# EasyEDA Pro project EasyEDA.epro

# Schematic Schematic1
Board Name: Board1; Create Date: 2025-07-10; Page Name: P1; Project Name: Pomodoro; Schematic Name: Schematic1; Update Date: 2025-07-14; Company: EasyEDA.com; Page Size: A4; Version: V1.0
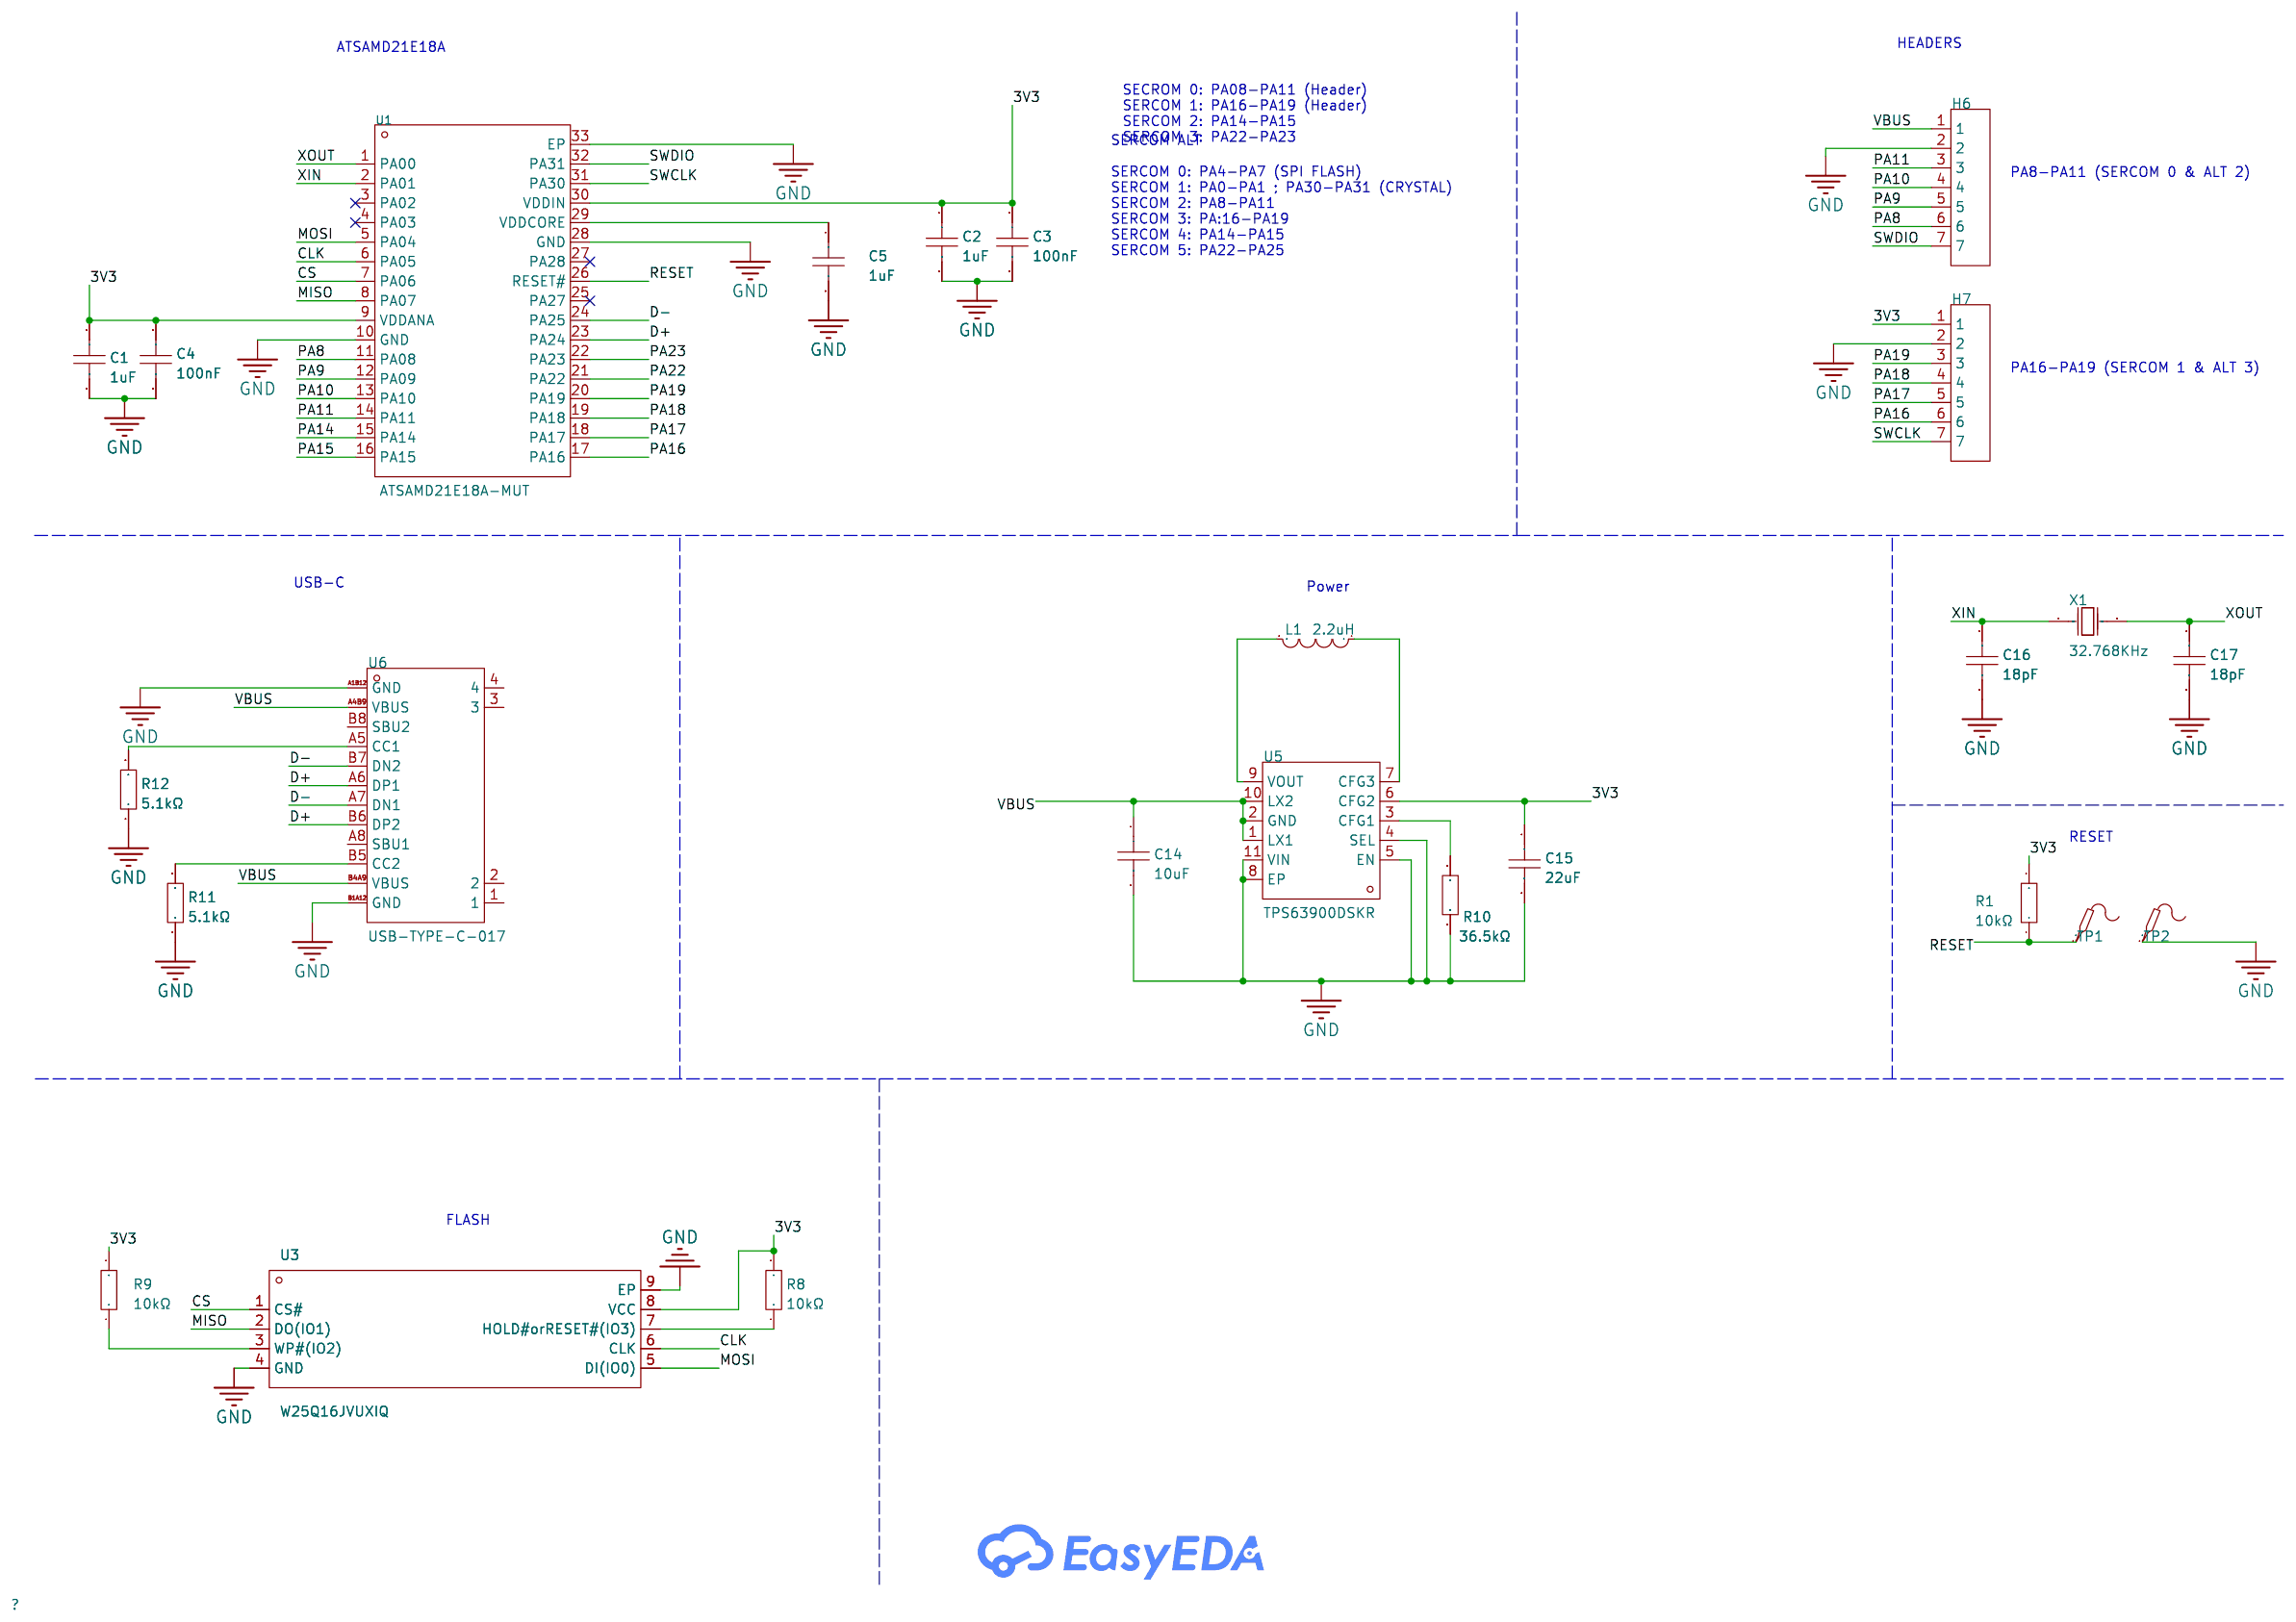
[diagram p0: schematic sheet]

## Parts
C1  1uF  [C0402]
C2  1uF  [C0402]
C3  100nF  [C0402]
C4  100nF  [C0402]
C5  1uF  [C0402]
C14  10uF  [C0402]
C15  22uF  [C0805]
C16  18pF  [C0402]
C17  18pF  [C0402]
H6  -  [HDR-TH_7P-P2.54-V-M]
H7  -  [HDR-TH_7P-P2.54-V-M]
L1  2.2uH  [IND-SMD_L4.5-W4.0_SLF0403-1]
R1  10kΩ  [R0402]
R8  10kΩ  [R0402]
R9  10kΩ  [R0402]
R10  36.5kΩ  [R0402]
R11  5.1kΩ  [R0402]
R12  5.1kΩ  [R0402]
TP1  -  [Test-Point-0.5mm]
TP2  -  [Test-Point-0.5mm]
U1  ATSAMD21E18A-MUT  [QFN-32_L5.0-W5.0-P0.50-TL-EP3.6]
U3  W25Q16JVUXIQ  [USON-8_L3.0-W2.0-P0.50-BL-EP]
U5  TPS63900DSKR  [WSON-10_L2.5-W2.5-W0.50-TL-EP]
U6  USB-TYPE-C-017  [USB-TYPE-C-SMD_C9900008089]
X1  32.768KHz  [OSC-SMD_L3.2-W1.5]

## Library data of the parts
C1 C2 C5 = CL05A105KA5NQNC: Capacitance: Tolerance:±10% Tolerance:±10% Voltage Rated: Temperature Coefficient:; LCSC Part Name: 1uF ±10% 25V; Supplier Part: C52923; Manufacturer: SAMSUNG(三星); Supplier Footprint: 0402; JLCPCB Part Class: Basic Part; Datasheet: https://atta.szlcsc.com/upload/public/pdf/source/20160218/1457707763339.pdf; Supplier: LCSC; Tolerance: ±10%
C3 C4 = CL05B104KO5NNNC: Capacitance: Tolerance:±10% Tolerance:±10% Voltage Rated: Temperature Coefficient:; LCSC Part Name: 100nF ±10% 16V; Supplier Part: C1525; Manufacturer: SAMSUNG(三星); Supplier Footprint: 0402; JLCPCB Part Class: Basic Part; Datasheet: https://atta.szlcsc.com/upload/public/pdf/source/20160218/1457707763339.pdf; Supplier: LCSC; Tolerance: ±10%
C14 = CL05A106MQ5NUNC: Capacitance: Tolerance:±20% Tolerance:±20% Voltage Rated: Temperature Coefficient:; LCSC Part Name: 10uF ±20% 6.3V; Supplier Part: C15525; Manufacturer: SAMSUNG(三星); Supplier Footprint: 0402; JLCPCB Part Class: Basic Part; Datasheet: https://atta.szlcsc.com/upload/public/pdf/source/20220823/2B02EE04F8F211D38A52DCB16EB6BEBA.pdf; Supplier: LCSC; Tolerance: ±20%
C15 = CL21A226MAQNNNE: Capacitance: Tolerance:±20% Tolerance:±20% Voltage Rated: Temperature Coefficient:; LCSC Part Name: 22uF ±20% 25V; Supplier Part: C45783; Manufacturer: SAMSUNG(三星); Supplier Footprint: 0805; JLCPCB Part Class: Basic Part; Datasheet: https://atta.szlcsc.com/upload/public/pdf/source/20160218/1457707763339.pdf; Supplier: LCSC; Tolerance: ±20%
C16 C17 = CAP_0402: Supplier Part: C1525; Supplier Footprint: 0402
H6 H7 = HDR-M_2.54_1x7P: Supplier Footprint: Through
L1 = CY43-2.2UH: Inductance: Tolerance:±20% Tolerance:±20% Rated Current: Saturation Current (Isat):- DC Resistance (DCR): Q @ Freq:- Frequency - Self Resonant:- Ratings:; LCSC Part Name: 2.2uH ±20%; Supplier Part: C2929416; Manufacturer: SHOU HAN(首韩); Supplier Footprint: SMD,4.5x4mm; JLCPCB Part Class: Extended Part; Datasheet: https://atta.szlcsc.com/upload/public/pdf/source/20211213/02D0D236E4480B75E64C77ABE9E913B4.pdf; Supplier: LCSC; Tolerance: ±20%
R1 R8 R9 = 0402WGF1002TCE: Type:Thick Film Resistors Resistance:10kΩ Tolerance:±1% Tolerance:±1% Power(Watts): Overload Voltage (Max): Temperature Coefficient:±100ppm/℃ Temperature Coefficient:±100ppm/℃ Operating Temperature Range:-55℃~+155℃ Operating Temperature Range:-55℃~+155℃; LCSC Part Name: 10kΩ ±1% 62.5mW 厚膜电阻; Supplier Part: C25744; Manufacturer: UNI-ROYAL(厚声); Supplier Footprint: 0402; JLCPCB Part Class: Basic Part; Datasheet: https://atta.szlcsc.com/upload/public/pdf/source/20200306/C422600_1E6D84923E4A46A82E41ADD87F860B5C.pdf; Supplier: LCSC; Type: Thick Film Resistors; Tolerance: ±1%; Temperature Coefficient: ±100ppm/℃; Operating Temperature Range: -55℃~+155℃
R10 = AC0402FR-0736K5L: Type:Thick Film Resistors Resistance:36.5kΩ Tolerance:±1% Tolerance:±1% Power(Watts):62.5mW Voltage-Supply(Max):50V Temperature Coefficient:±100ppm/℃ Temperature Coefficient:±100ppm/℃ Operating Temperature:-55℃~+155℃ Operating Temperature:-55℃~+155℃; LCSC Part Name: 厚膜电阻 36.5kΩ ±1% 62.5mW; Supplier Part: C144766; Manufacturer: YAGEO(国巨); Supplier Footprint: 0402; JLCPCB Part Class: Extended Part; Datasheet: https://atta.szlcsc.com/upload/public/pdf/source/20180927/C229861_4ABDC471507C1ED6AFB4BA66AFC8620A.pdf; Supplier: LCSC; Type: Thick Film Resistors; Tolerance: ±1%; Power(Watts): 62.5mW; Voltage-Supply(Max): 50V; Temperature Coefficient: ±100ppm/℃; Operating Temperature: -55℃~+155℃
R11 R12 = 0402WGF5101TCE: Type:Thick Film Resistors Resistance:5.1kΩ Tolerance:±1% Tolerance:±1% Power(Watts): Overload Voltage (Max): Temperature Coefficient:±100ppm/℃ Temperature Coefficient:±100ppm/℃ Operating Temperature Range:-55℃~+155℃ Operating Temperature Range:-55℃~+155℃; LCSC Part Name: 5.1kΩ ±1% 62.5mW 厚膜电阻; Supplier Part: C25905; Manufacturer: UNI-ROYAL(厚声); Supplier Footprint: 0402; JLCPCB Part Class: Basic Part; Datasheet: https://atta.szlcsc.com/upload/public/pdf/source/20200306/C422600_1E6D84923E4A46A82E41ADD87F860B5C.pdf; Supplier: LCSC; Type: Thick Film Resistors; Tolerance: ±1%; Temperature Coefficient: ±100ppm/℃; Operating Temperature Range: -55℃~+155℃
TP1 TP2 = Test-Point: Test Point 测试点
U1 = ATSAMD21E18A-MUT: CPU Core:CM0 Program Storage Size:256KB RAM Size:32KB GPIO Ports Number:26 Operating Voltage Range:1.62V~3.6V Operating Voltage Range:1.62V~3.6V CPU Maximum Speed:48MHz Program Memory Type:FLASH Operating Temperature Range:-40℃~+85℃ Operating Temperature; Supplier Part: C2052801; Manufacturer: MICROCHIP(美国微芯); Supplier Footprint: QFN-32-EP(5x5); Datasheet: https://atta.szlcsc.com/upload/public/pdf/source/20210708/C2052801_3DDCFB387CD31D84F52B38088396EAFD.pdf; Supplier: LCSC; CPU Core: CM0; Program Storage Size: 256KB; RAM Size: 32KB; GPIO Ports Number: 26; Operating Voltage Range: 1.62V~3.6V; CPU Maximum Speed: 48MHz; Program Memory Type: FLASH; Operating Temperature Range: -40℃~+85℃; ADC (Bit): 12bit; DAC (Bit): 10bit; Peripheral/Function: DMA；WDT；LIN总线协议；PWM; Watchdog: 有; Direct Memory Access: 有; Internal Oscillator: 有
U3 = W25Q16JVUXIQ: Supplier Part: C2843335; Manufacturer: WINBOND(华邦); Supplier Footprint: USON-8-EP(2x3); JLCPCB Part Class: Extended Part; Datasheet: https://atta.szlcsc.com/upload/public/pdf/source/20210629/C2843335_FB4D78B5076715625DC0C83F790D3044.pdf; Supplier: LCSC
U5 = TPS63900DSKR: Input Voltage:1.8V~5.5V Input Voltage:1.8V~5.5V Output Current:400mA Switching Frequency:- Switching Frequency:- Operating Temperature:-40℃~+125℃@(TJ) Operating Temperature:-40℃~+125℃@(TJ) Synchronous Rectification:Yes Number of Outputs:- Topology:Step-do; LCSC Part Name: 1.8V至5.5V,75nA超低静态电流同步升降压转换器; Supplier Part: C1518762; Manufacturer: TI(德州仪器); Supplier Footprint: WSON-10-EP(2.5x2.5); Datasheet: https://www.ti.com/cn/lit/gpn/tps63900; Supplier: LCSC; Input Voltage: 1.8V~5.5V; Output Current: 400mA; Operating Temperature: -40℃~+125℃@(TJ); Synchronous Rectification: Yes; Topology: Step-down-Boost
U6 = USB-TYPE-C-017: Connector Type:Type-C Standard:- Gender:Female Number of Ports:1 Number of Contacts:16P Mounting Style:卧贴 Current Rating - Power (Max):3A Operating Temperature Range:-25℃~+85℃ Operating Temperature Range:-25℃~+85℃; LCSC Part Name: Type-C 母 卧贴; Supplier Part: C2927037; Manufacturer: DEALON(德艺隆); Supplier Footprint: SMD; JLCPCB Part Class: Extended Part; Datasheet: https://atta.szlcsc.com/upload/public/pdf/source/20211217/653222EE5174722C9DFE2966329956D8.pdf; Supplier: LCSC; Connector Type: Type-C; Gender: Female; Number of Ports: 1; Number of Contacts: 16P; Mounting Style: 卧贴; Current Rating - Power (Max): 3A; Operating Temperature Range: -25℃~+85℃
X1 = 32.768KHz: Supplier: LCSC; Manufacturer: EPSON; Manufacturer Part: FC-135R; Supplier Part: C94276; JLCPCB Part Class: Extended Part

## Nets
3V3: C1.1 C2.1 C3.1 C4.1 C15.1 H7.1 R1.2 R8.2 R9.2 U1.9(VDDANA) U1.30(VDDIN) U3.8(VCC) U5.6(CFG2)
GND: C1.2 C2.2 C3.2 C4.2 C5.2 C14.2 C15.2 C16.2 C17.2 H6.2 H7.2 R10.2 R11.1 R12.1 TP2.1 U1.10(GND) U1.28(GND) U1.33(EP) U3.4(GND) U3.9(EP) U5.4(SEL) U5.5(EN) U5.8(EP) U5.11(VIN) U6.A1B12(GND) U6.B1A12(GND)
VBUS: C14.1 H6.1 U5.1(LX1) U5.2(GND) U5.10(LX2) U6.A4B9(VBUS) U6.B4A9(VBUS)
CLK: U1.6(PA05) U3.6(CLK)
CS: U1.7(PA06) U3.1(CS#)
D+: U1.23(PA24) U6.A6(DP1) U6.B6(DP2)
D-: U1.24(PA25) U6.A7(DN1) U6.B7(DN2)
MISO: U1.8(PA07) U3.2(DO(IO1))
MOSI: U1.5(PA04) U3.5(DI(IO0))
PA8: H6.6 U1.11(PA08)
PA9: H6.5 U1.12(PA09)
PA10: H6.4 U1.13(PA10)
PA11: H6.3 U1.14(PA11)
PA14: U1.15(PA14)
PA15: U1.16(PA15)
PA16: H7.6 U1.17(PA16)
PA17: H7.5 U1.18(PA17)
PA18: H7.4 U1.19(PA18)
PA19: H7.3 U1.20(PA19)
PA22: U1.21(PA22)
PA23: U1.22(PA23)
RESET: R1.1 TP1.1 U1.26(RESET#)
SWCLK: H7.7 U1.31(PA30)
SWDIO: H6.7 U1.32(PA31)
XIN: C16.1 U1.2(PA01) X1.1(OSC1)
XOUT: C17.1 U1.1(PA00) X1.2(OSC2)
$1N1458: C5.1 U1.29(VDDCORE)
$1N4917: R8.1 U3.7(HOLD#orRESET#(IO3))
$1N4956: R9.1 U3.3(WP#(IO2))
$1N22571: L1.1 U5.7(CFG3)
$1N22572: L1.2 U5.9(VOUT)
$1N22774: R10.1 U5.3(CFG1)
$1N24492: R11.2 U6.B5(CC2)
$1N24548: R12.2 U6.A5(CC1)

Not connected (* = marked no-connect by the designer): U1 3(PA02)* 4(PA03)* 25(PA27)* 27(PA28)*; U6 1 2 3 4 A8(SBU1) B8(SBU2)

## Notes on the sheet
- ATSAMD21E18A
- HEADERS
- SECROM 0: PA08-PA11 (Header)
  SERCOM 1: PA16-PA19 (Header)
  SERCOM 2: PA14-PA15
  SERCOM 3: PA22-PA23
- PA8-PA11 (SERCOM 0 & ALT 2)
- SERCOM ALT
  SERCOM 0: PA4-PA7 (SPI FLASH)
  SERCOM 1: PA0-PA1 ; PA30-PA31 (CRYSTAL)
  SERCOM 2: PA8-PA11
  SERCOM 3: PA:16-PA19
  SERCOM 4: PA14-PA15
  SERCOM 5: PA22-PA25
- PA16-PA19 (SERCOM 1 & ALT 3)
- USB-C
- Power
- RESET
- FLASH

# Board PCB1
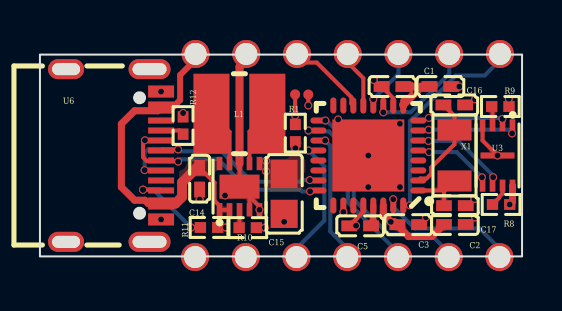
[diagram p1: board, top side]
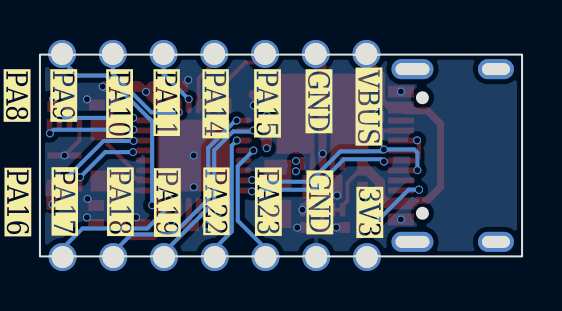
[diagram p2: board, bottom side, seen from below]

Outline 24.14 x 10.1 mm; copper layers: Top Layer, Inner1, Inner2, Bottom Layer. Coordinates in mm from the lower left corner of the outline.
Outline path: rectangle 0,10.1 24.14,0
Stack: Top Layer 0.035mm Outer layer thickness 1oz / Dielectric1 0.2104mm 7628 RC49% 8.6mil / Inner1 0.0152mm Inner layer thickness / Dielectric2 1.065mm 1.1mm H/HOZ Copper / Inner2 0.0152mm Inner layer thickness / Dielectric3 0.2104mm 7628 RC49% 8.6mil / Bottom Layer 0.035mm Outer layer thickness 1oz

## Design rules (mm)
net D-: DP1
net D+: DP1
template: Custom Config
spacing copperThickness1oz (default): track to track 0.1, other pairs 0 to 0.3
spacing copperThickness2oz: track to track 0.1, other pairs 0.152 to 0.3
track width copperThickness1oz (default): min 0.1, default 0.2, max 1
track width copperThickness2oz: min 0.203, default 0.254, max 2.54
differential pair differentialPair (default): width min 0.127, default 0.2, max 2.54; gap min 0.152, default 0.2
via viaSize (default): diameter min 0.3, default 0.4, max 10; hole min 0.3, default 0.3, max 6.3
via SmallerVia: diameter min 0.25, default 0.3, max 10; hole min 0.15, default 0.2, max 6.3
net 3V3 uses copperRegion1
net VBUS uses copperRegion1

## Placement (name value [footprint] x y rotation side)
C1  1uF  [C0402]  20.05 8.5 0 top
C2  1uF  [C0402]  20.78 1.6 0 top
C3  100nF  [C0402]  18.44 1.59 0 top
C4  100nF  [C0402]  17.65 8.5 180 top
C5  1uF  [C0402]  16.03 1.53 180 top
C14  10uF  [C0402]  8 3.89 270 top
C15  22uF  [C0805]  12.23 3.13 270 top
C16  18pF  [C0402]  20.75 7.58 0 top
C17  18pF  [C0402]  20.78 2.54 0 top
H6  -  [HDR-TH_7P-P2.54-V-M]  15.41 10.13 0 top
H7  -  [HDR-TH_7P-P2.54-V-M]  15.39 -0.03 0 top
L1  2.2uH  [IND-SMD_L4.5-W4.0_SLF0403-1]  9.99 7.14 180 top
R1  10kΩ  [R0402]  12.79 6.17 270 top
R8  10kΩ  [R0402]  23.09 2.6 0 top
R9  10kΩ  [R0402]  23.05 7.5 0 top
R10  36.5kΩ  [R0402]  10.41 1.44 0 top
R11  5.1kΩ  [R0402]  8.47 1.45 180 top
R12  5.1kΩ  [R0402]  7.17 6.55 270 top
TP1  -  [Test-Point-0.5mm]  12.78 8.11 0 top
TP2  -  [Test-Point-0.5mm]  13.44 8.1 0 top
U1  ATSAMD21E18A-MUT  [QFN-32_L5.0-W5.0-P0.50-TL-EP3.6]  16.44 5.05 180 top
U3  W25Q16JVUXIQ  [USON-8_L3.0-W2.0-P0.50-BL-EP]  22.91 5.05 180 top
U5  TPS63900DSKR  [WSON-10_L2.5-W2.5-W0.50-TL-EP]  9.99 3.49 90 top
U6  USB-TYPE-C-017  [USB-TYPE-C-SMD_C9900008089]  3.69 5.05 270 top
X1  32.768KHz  [OSC-SMD_L3.2-W1.5]  20.76 5.05 270 top

## Footprints (pads in the part's own frame, mm; a bottom-side part is the same pattern mirrored in y, then rotated)
C0402
  rect 0.79x0.54 smd: 1(-0.545,0) 2(0.545,0)
C0805
  rect 1.41x1.35 smd: 1(-1,0) 2(1,0)
HDR-TH_7P-P2.54-V-M
  round 1.4 hole 1.1x0.9: 1(-7.62,0) 2(-5.08,0) 3(-2.54,0) 4(0,0) 5(2.54,0) 6(5.08,0) 7(7.62,0)
IND-SMD_L4.5-W4.0_SLF0403-1
  rect 1.8x4 smd: 1(-1.4,0) 2(1.4,0)
OSC-SMD_L3.2-W1.5
  rect 1.05x1.7 smd: 1(-1.275,0) 2(1.275,0)
QFN-32_L5.0-W5.0-P0.50-TL-EP3.6
  oval 0.8x0.299 smd: 1(-2.5,1.75) 2(-2.5,1.25) 3(-2.5,0.75) 4(-2.5,0.25) 5(-2.5,-0.25) 6(-2.5,-0.75) 7(-2.5,-1.25) 8(-2.5,-1.75) 17(2.5,-1.75) 18(2.5,-1.25) 19(2.5,-0.75) 20(2.5,-0.25) 21(2.5,0.25) 22(2.5,0.75) 23(2.5,1.25) 24(2.5,1.75)
  oval 0.3x0.8 smd: 9(-1.75,-2.5) 10(-1.25,-2.5) 11(-0.75,-2.5) 12(-0.25,-2.5) 13(0.25,-2.5) 14(0.75,-2.5) 15(1.25,-2.5) 16(1.75,-2.5) 25(1.75,2.5) 26(1.25,2.5) 27(0.75,2.5) 28(0.25,2.5) 29(-0.25,2.5) 30(-0.75,2.5) 31(-1.25,2.5) 32(-1.75,2.5)
  rect 3.6x3.6 smd: 33(0,0)
R0402
  rect 0.566x0.54 smd: 1(-0.433,0) 2(0.433,0)
Test-Point-0.5mm
  round 0.5 smd: 1(0,0)
USB-TYPE-C-SMD_C9900008089
  oval 1x2.1 hole 0.6x1.7: 1(-4.32,1.801) 2(4.32,1.801)
  oval 1x1.8 hole 0.6x1.4: 3(-4.32,-2.379) 4(4.32,-2.379)
  rect 0.6x1.3 smd: A1B12(-3.2,2.379) A4B9(-2.4,2.379) B1A12(3.2,2.379) B4A9(2.4,2.379)
  rect 0.3x1.3 smd: A5(-1.25,2.379) A6(-0.25,2.379) A7(0.25,2.379) A8(1.25,2.379) B5(1.75,2.379) B6(0.75,2.379) B7(-0.75,2.379) B8(-1.75,2.379)
USON-8_L3.0-W2.0-P0.50-BL-EP
  rect 0.28x0.6 smd: 1(-0.75,-1.508) 2(-0.25,-1.508) 3(0.25,-1.508) 4(0.75,-1.508) 5(0.75,1.508) 6(0.25,1.508) 7(-0.25,1.508) 8(-0.75,1.508)
  rect 1.7x0.3 smd: 9(0,0)
WSON-10_L2.5-W2.5-W0.50-TL-EP
  rect 0.665x0.28 smd: 1(-1.157,1) 2(-1.157,0.5) 3(-1.157,0) 4(-1.157,-0.5) 5(-1.157,-1) 6(1.157,-1) 7(1.157,-0.5) 8(1.157,0) 9(1.157,0.5) 10(1.157,1)
  rect 1.2x2 smd: 11(0,0)

## Nets
As in the schematic.

Pads without a net: U1 3 4 25 27; U6 1 2 3 4 A8 B8

## Via types
v1: diameter 0.4, hole 0.3, Top Layer to Bottom Layer, 58 vias

## Routing (per net, layer and track width the routed paths; a pad name or vN(x,y) marks a point on that pad's centre or on a via; arc(x,y) is an arc through that point)
3V3: length 8.1
  Top Layer w0.2: R1.2 v1(12.79,5.42)
  Top Layer w0.35: U1.30 17.19,2.13 17.57,1.75 v1(17.57,1.73) 17.76,1.73 C3.1 17.9,1.55 18.46,0.99 19.62,0.99 C2.1 ; R8.2 23.66,2.74 U3.8
  Top Layer w0.39: 19.51,8.5 19.1,8.5 v1(18.83,8.23) ; U1.9 18.19,7.59 v1(18.83,8.23) ; v1(18.83,8.23) 18.83,8.28 18.57,8.54 18.2,8.54
  vias: v1(11.32,4.78) v1(11.32,4.26) v1(23.48,7.89) v1(23.52,2.6)
GND: length 13.5
  Top Layer w0.2: 10.49,2.99 U5.4 ; 10.49,2.99 10.99,2.49 v1(10.99,2.33) ; 10.49,2.99 U5.11 U5.8 ; U1.28 16.19,2.23 16.09,2.14 16.09,2.13 15.86,1.9 15.85,1.9 C5.2 ; U1.10 17.69,7.92 C4.2 ; U3.4 22.16,5.8 v1(22.91,5.05) ; TP2.1 v1(13.44,7.55)
  Top Layer w0.4: 10.31,9.8 9.99,9.49 U5.8
  vias: v1(6.07,8.25) v1(6.07,1.85) v1(7.17,7.18) v1(8,2.85) v1(9.27,3.05) v1(9.3,1.45) v1(9.99,5.14) v1(11.26,1.44) v1(12.23,1.73) v1(14.93,6.85) v1(15.83,1.54) v1(16.44,3.47) v1(16.44,5.05) v1(16.71,8.83) v1(18.02,6.64) v1(18.03,3.47) v1(19.33,1.96) v1(21,8.5) v1(21.79,7.86) v1(21.75,2.88) v1(21.79,1.95)
VBUS: length 17.4
  Top Layer w0.2: U5.2 U5.1 8.99,2.53 8.74,2.79 8.74,3.69 C14.1
  Top Layer w0.3: U6.A4B9 6.64,7.45 7.02,7.83 7.02,9.08 7.79,9.85
  Top Layer w0.35: U6.B4A9 5.42,2.65 5.26,2.81 4.73,2.81 4.08,3.47 4.08,6.63 4.74,7.29 5.9,7.29 U6.A4B9
  Top Layer w0.5: U6.B4A9 6.78,2.65 7.12,2.98 7.12,3.7 7.85,4.44 C14.1
CLK: length 4
  Bottom Layer w0.2: v1(19.45,5.78) 20.95,5.78 22.58,4.15 22.58,4.07 v1(22.69,3.96)
CS: length 4.3
  Bottom Layer w0.2: v1(23.64,6.16) 23.46,6.34 v1(19.46,6.34)
D+: length 11.6
  Top Layer w0.2: U6.A6 6.12,5.35 v1(6.92,5.35) ; U6.B6 6.05,4.32 v1(5.24,4.32)
  Bottom Layer w0.2: v1(5.24,4.32) 5.24,5.19 5.4,5.35 v1(6.92,5.35) 7.01,5.26 9.09,5.26 10.61,3.74 13.03,3.74 13.11,3.82 v1(13.51,3.82)
D-: length 10.1
  Top Layer w0.2: 6.04,4.77 6.89,4.77 v1(6.92,4.75) ; 6.04,4.77 U6.A7 ; 6.04,4.77 5.36,4.77 5.16,4.96 5.16,5.72 v1(5.26,5.81)
  Bottom Layer w0.2: v1(13.52,3.25) 13.12,3.25 13.04,3.34 10.44,3.34 8.92,4.86 7.03,4.86 v1(6.92,4.75)
MISO: length 3.7
  Bottom Layer w0.2: v1(23.15,6.88) 23.11,6.93 v1(19.47,6.93)
MOSI: length 3.2
  Bottom Layer w0.2: v1(22.13,3.96) 20.87,5.22 v1(19.48,5.22)
PA8: length 4.7
  Bottom Layer w0.2: 20.49,9.7 20.49,9.14 18.56,7.21 v1(17.19,7.21)
PA9: length 2.4
  Bottom Layer w0.2: 17.95,9.7 17.95,9.13 v1(16.69,7.87)
PA10: length 2.5
  Top Layer w0.2: 15.41,9.7 16.19,8.92 U1.13
PA11: length 3.9
  Top Layer w0.2: U1.14 15.59,7.65 15.59,7.97 13.86,9.7 12.87,9.7
PA16: length 10.3
  Bottom Layer w0.2: 20.47,0.4 20.27,0.4 19.57,1.1 17.47,1.1 15.72,2.85 15.72,5.43 14.35,6.8 v1(14.29,6.8)
PA17: length 8.7
  Bottom Layer w0.2: 17.93,0.4 17.73,0.4 15.42,2.71 15.42,5.3 14.47,6.25 13.5,6.25 v1(13.45,6.3) ; 17.93,0.2 H7.5
PA18: length 5.9
  Bottom Layer w0.2: 15.39,0.4 14.54,1.25 14.54,5.55 v1(14.28,5.8)
PA19: length 5.8
  Bottom Layer w0.2: v1(13.45,5.3) 14.24,4.52 14.24,1.79 12.85,0.4
RESET: length 7.1
  Top Layer w0.2: 12.71,8.11 12.78,8.04 v1(12.78,7.05)
  Inner2 w0.2: v1(15.19,2.22) 15.19,4.25 14.1,5.35 14.09,5.35 13.83,5.61 13.83,5.62 13.6,5.85 13.26,5.85 12.78,6.33 v1(12.78,7.05)
SWCLK: length 6.6
  Bottom Layer w0.2: v1(17.69,2.86) 17.69,2.48 18.77,1.4 22.01,1.4 23.01,0.4
SWDIO: length 10.3
  Top Layer w0.2: v1(18.52,2.56) 18.51,2.55 U1.32
  Bottom Layer w0.2: v1(18.52,2.56) 18.52,6.77 18.67,6.91 18.69,6.91 20.79,9.01 20.79,9.03 20.81,9.05 22.27,9.05 22.92,9.7 23.03,9.7
XIN: length 4.9
  Top Layer w0.2: U1.2 19.04,3.9 19.36,3.9 19.59,4.13 19.59,4.45 20.76,5.61 X1.1 20.76,7.03 C16.1
XOUT: length 2.8
  Top Layer w0.2: 20.28,3.3 U1.1 ; 20.28,3.3 20.23,3.25 C17.1 ; 20.28,3.3 X1.2
$1N1458: length 1
  Top Layer w0.3: 16.46,1.6 16.69,1.83 U1.29
$1N4917: length 1.2
  Top Layer w0.2: U3.7 23.16,3.15 22.99,2.97 22.99,2.93 R8.1
$1N4956: length 1
  Top Layer w0.2: R9.1 22.66,7.46 U3.3
$1N22571: length 2.9
  Top Layer w0.2: L1.1 10.49,6.25 U5.7
$1N22572: length 2.9
  Top Layer w0.2: U5.9 9.49,6.23 L1.2
$1N22774: length 0.9
  Top Layer w0.2: R10.1 9.99,1.46 U5.3
$1N24492: length 4.6
  Top Layer w0.2: v1(7.57,1.45) R11.2 ; v1(5.16,3.34) 6.03,3.34 U6.B5
  Bottom Layer w0.2: v1(5.16,3.34) 5.68,3.34 v1(7.57,1.45)
$1N24548: length 1.2
  Top Layer w0.2: R12.2 6.98,6.3 U6.A5

## Copper pours and planes (outline as drawn; the poured copper is in the pictures)
3V3 on Top Layer: 10.75,5.06 10.75,4.26 11.32,3.69 11.32,3.49 11.59,3.22 13.31,3.22 13.32,3.23 13.26,5.85 10.79,5.02
3V3 on Inner2: -2.36,10.3 24.21,10.3 24.21,-0.34 -2.36,-0.34
GND on Bottom Layer: -2.36,10.3 24.14,10.3 24.14,-0.2 -2.36,-0.2
GND on Inner1: -2.36,10.3 24.14,10.3 24.14,-0.31 -2.36,-0.31
VBUS on Top Layer: 8.68,3.89 8.68,3.98 8.9,4.2 9.21,4.2 9.23,4.22 9.23,5.03 9.2,5.06 6.29,5.06 6.27,5.04 6.27,4.62 5.56,3.91 5.56,3.8 7.56,3.8 7.65,3.89

Small or netless copper shapes (teardrops, artwork), in the pictures only: 38 on Top Layer, 9 on Bottom Layer, 2 on Inner2

## Text on the board
Bottom Silkscreen Layer: 3V3 | VBUS | GND | PA23 | PA15 | PA22 | PA14 | PA19 | PA11 | PA18 | PA10 | PA17 | PA9 | PA16 | PA8
